# EAGLE design external_strip_v3 (EAGLE 7.2.0)
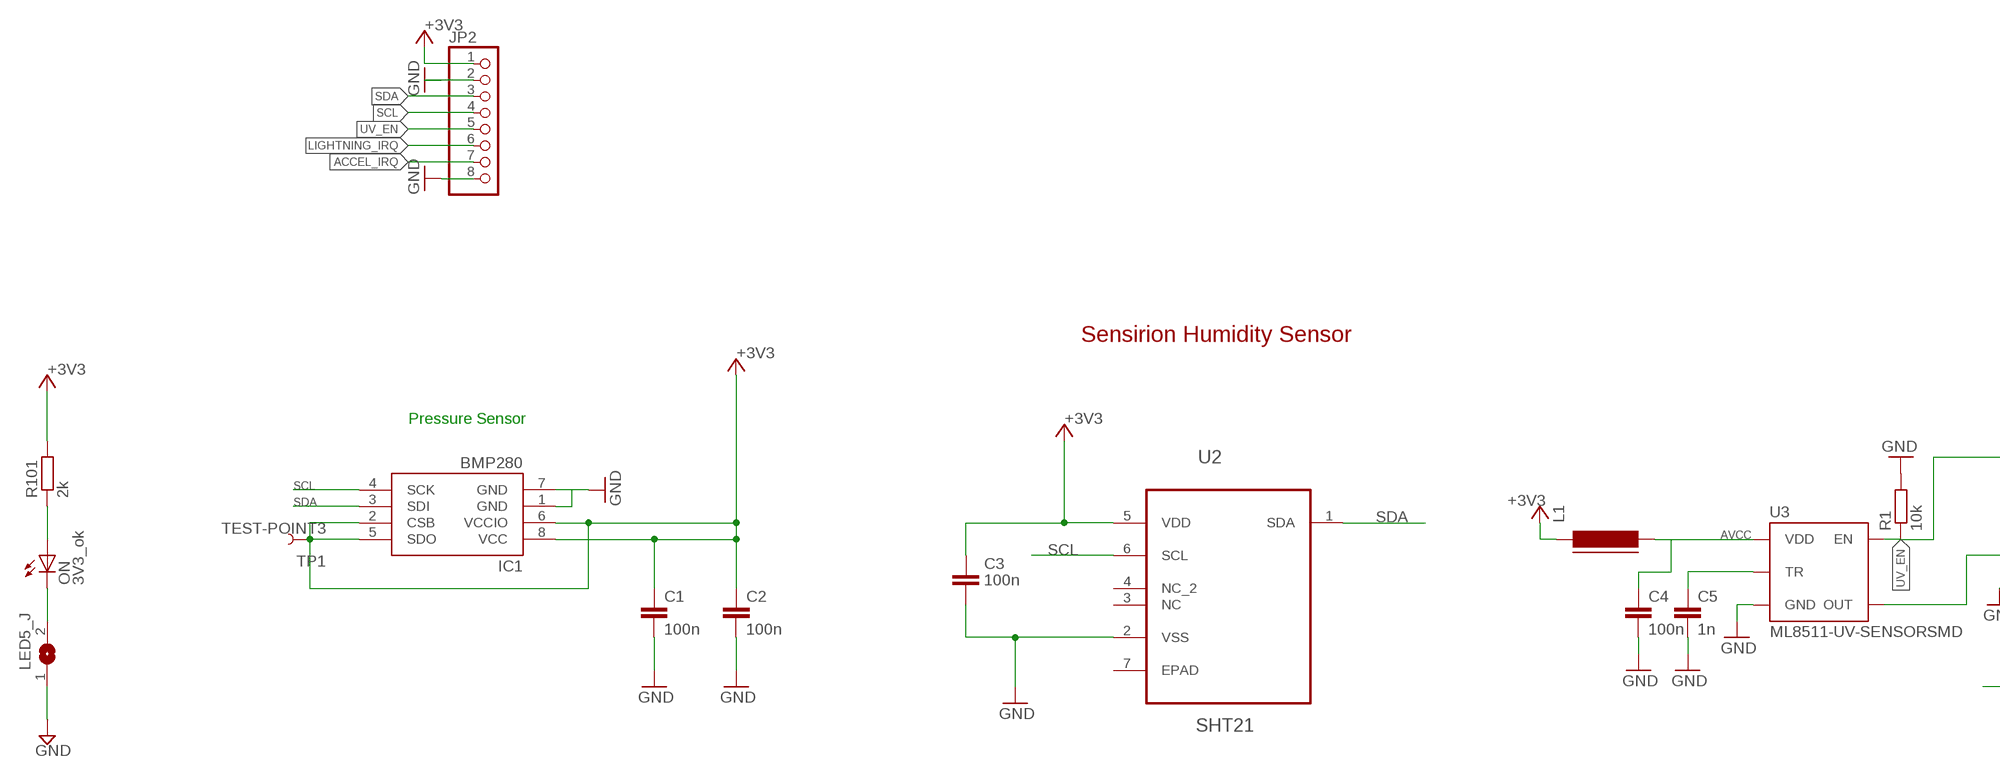
[diagram p0: schematic, sheet 1, part 1 of 2]
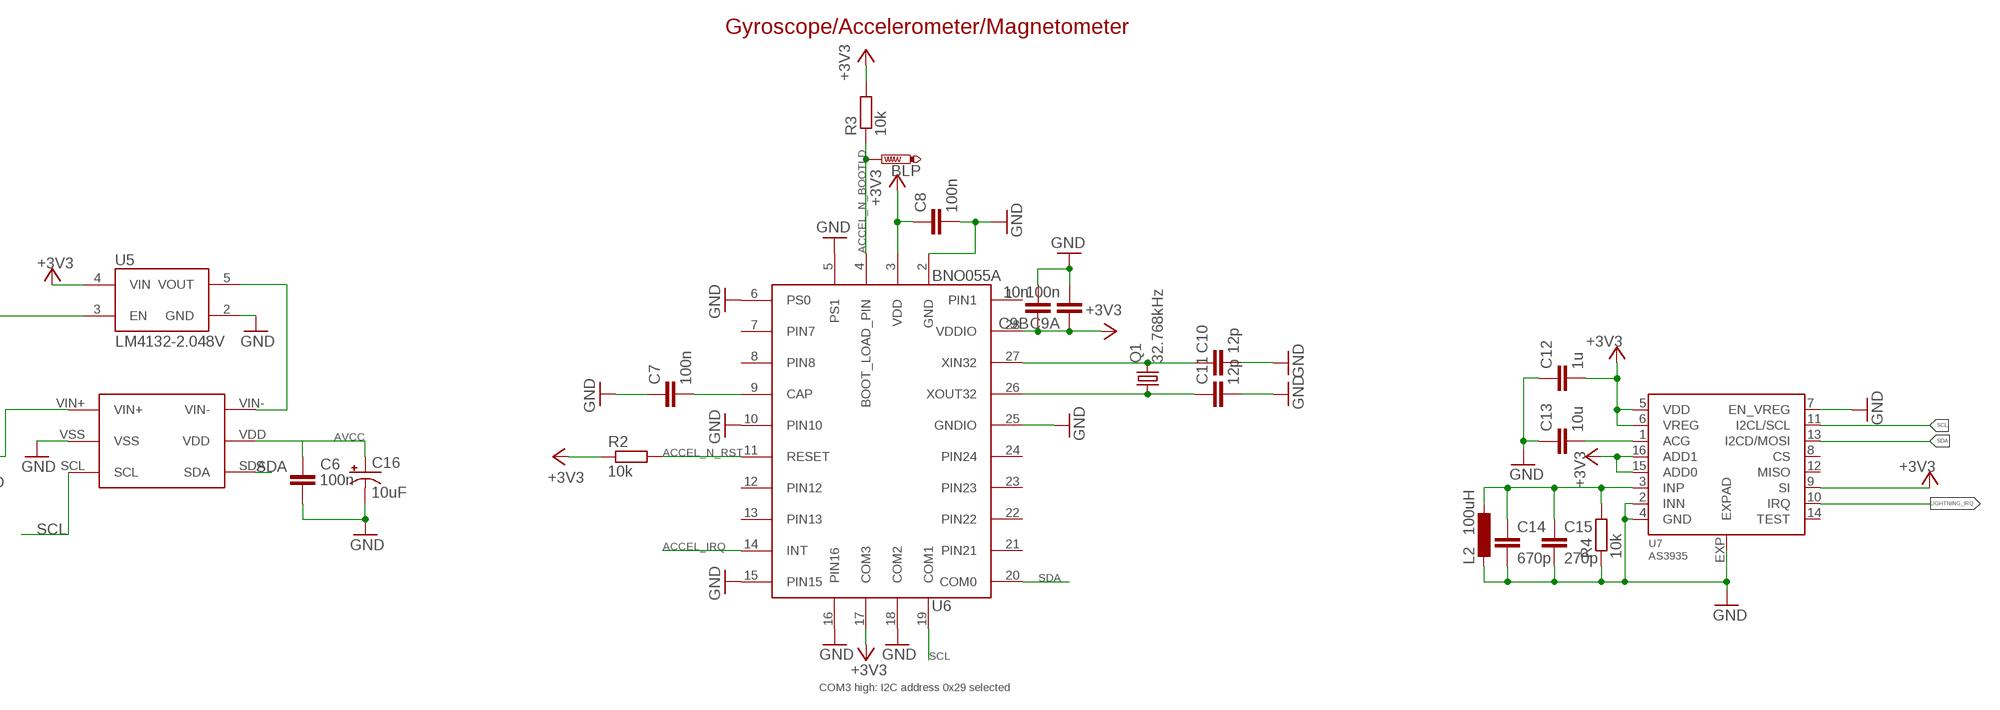
[diagram p1: schematic, sheet 1, part 2 of 2]

## Parts
BLP  PTR1B1,27  [B1,27]
C1  100n  C-EUC0603  [C0603]
C2  100n  C-EUC0603  [C0603]
C3  100n  C-EUC0603  [C0603]
C4  100n  0.1UF-25V(+80/-20%)(0603)  [0603-CAP]
C5  1n  1NF/1000PF-50V-10%(0603)  [0603-CAP]
C6  100n  C-EUC0603  [C0603]
C7  100n  C-EUC0603  [C0603]
C8  100n  C-EUC0603  [C0603]
C9A  100n  C-EUC0603  [C0603]
C9B  10n  C-EUC0603  [C0603]
C10  12p  C-EUC0603  [C0603]
C11  12p  C-EUC0603  [C0603]
C12  1u  C-EUC0603  [C0603]
C13  10u  C-EUC0603  [C0603]
C14  670p  C-EUC0603  [C0603]
C15  270p  C-EUC0603  [C0603]
C16  10uF  10UF-TANT  [EIA3216]
IC1  BMP280  [LGA8]
JP2  PINHD-1X8  [1X08]
L1  FERRITE-0603  [FB603]
L2  100uH  COILCRAFT  [COILCRAFT]
LED5_J  SJ  [SJ]
ON  3V3_ok  LEDCHIPLED_0603  [CHIPLED_0603]
Q1  32.768kHz  FC-12M  [FC-12M]
R1  10k  R-EU_R0603  [R0603]
R2  10k  R-EU_R0603  [R0603]
R3  10k  R-EU_R0603  [R0603]
R4  10k  R-EU_R0603  [R0603]
R101  2k  R-EU_R0603  [R0603]
TP1  TEST-POINT3  [PAD.03X.03]
U2  SHT21  [DFN300X300X110-7N]
U3  ML8511-UV-SENSORSMD  [ML8511]
U4  MCP3425  [SOT-23-6]
U5  LM4132-2.048V  LM4128-2.5VREF  [SOT23-5]
U6  BNO055A  [BNO055]
U7  AS3935  [16LDMLPQ]

## Nets
+3V3 [power]: C1.1 C2.1 C3.1 C8.1 C9A.1 C9B.1 C12.2 IC1.2(CSB) IC1.5(SDO) IC1.6(VCCIO) JP2.1 L1.1 R2.1 R3.2 R101.2 TP1.P$1 U2.5(VDD) U5.4(VIN) U6.3(VDD) U6.17(COM3) U6.28(VDDIO) U7.5(VDD) U7.6(VREG) U7.9(SI) U7.15(ADD0) U7.16(ADD1)
ACCEL_IRQ: JP2.7 U6.14(INT)
ACCEL_N_BOOTLD: BLP.TP R3.1 U6.4(BOOT_LOAD_PIN)
ACCEL_N_RST: R2.2 U6.11(RESET)
AVCC [power]: C4.1 C6.1 C16.A(+) L1.2 U3.7(VDD) U4.VDD
GND: C1.2 C2.2 C3.2 C4.2 C5.2 C6.2 C7.1 C8.2 C9A.2 C9B.2 C10.2 C11.2 C12.1 C13.1 C14.2 C15.2 C16.C(-) IC1.1(GND) IC1.7(GND) JP2.2 JP2.8 L2.2 LED5_J.1 R1.2 R4.1 U2.2(VSS) U3.5(GND) U4.VSS U5.2(GND) U6.2(GND) U6.5(PS1) U6.6(PS0) U6.10(PIN10) U6.15(PIN15) U6.16(PIN16) U6.18(COM2) U6.25(GNDIO) U7.2(INN) U7.4(GND) U7.7(EN_VREG) U7.EXP(EXPAD)
LIGHTNING_IRQ: JP2.6 U7.10(IRQ)
N$1: U3.8(OUT) U4.VIN+
N$2: C13.2 U7.1(ACG)
N$3: C5.1 U3.9(TR)
N$4: LED5_J.2 ON.C
N$5: C14.1 C15.1 L2.1 R4.2 U7.3(INP)
N$6: U4.VIN- U5.5(VOUT)
N$8: ON.A R101.1
N$18: C7.2 U6.9(CAP)
N$19: C10.1 Q1.2 U6.27(XIN32)
N$73: C11.1 Q1.1 U6.26(XOUT32)
SCL: IC1.4(SCK) JP2.4 U2.6(SCL) U4.SCL U6.19(COM1) U7.11(I2CL/SCL)
SDA: IC1.3(SDI) JP2.3 U2.1(SDA) U4.SDA U6.20(COM0) U7.13(I2CD/MOSI)
UV_EN: JP2.5 R1.1 U3.4(EN) U5.3(EN)
Unconnected: U2.3(NC) U2.4(NC_2) U2.7(EPAD) U6.1(PIN1) U6.7(PIN7) U6.8(PIN8) U6.12(PIN12) U6.13(PIN13) U6.21(PIN21) U6.22(PIN22) U6.23(PIN23) U6.24(PIN24) U7.8(CS) U7.12(MISO) U7.14(TEST)

## Notes on the sheet
- Gyroscope/Accelerometer/Magnetometer
- Sensirion Humidity Sensor
- Pressure Sensor
- COM3 high: I2C address 0x29 selected

## Power pins joined to a net without a drawn wire
VCC: IC1.8(VCC)

## Library data of the parts
BLP = testpad:PTR1: TEST PIN
C1-C3 C6-C8 C9A C9B C10-C15 = rcl:C-EU: CAPACITOR, European symbol
C4 = SparkFun-Capacitors:0.1UF-25V(+80/-20%)(0603): CAP-00810 Ceramic Standard decoupling cap; PROD_ID: CAP-00810; VALUE: 0.1uF
C5 = SparkFun-Capacitors:1NF/1000PF-50V-10%(0603): CAP-07886; PROD_ID: CAP-07886; VALUE: 1nF
C16 = SparkFun-Retired:10UF-TANT: 10uF Tantalum SMT CAP-00811- 16V 10% (EIA-3216); PROD_ID: CAP-00811
IC1 = we-sensor:BMP280: Bosch BMP280 Pressure Sensor
JP2 = Headerlibrary:PINHD-1X8: PIN HEADER
L1 = dp_devices:FERRITE: Ferrite bead in various packages
L2 = AS3935:COILCRAFT
LED5_J = jumper:SJ: SMD solder JUMPER
ON = adafruit:LED: LED OSRAM: - CHIPLED LG R971, LG N971, LY N971, LG Q971, LY Q971, LO R971, LY R971 LH N974, LH R974 LS Q976, LO Q976, LY Q976 LO Q996 - Hyper CHIPLED LW Q18S LB Q993, LB Q99A, LB R99A - SideLED LS A670, LO A670, LY A670, LG A670, LP A670 LB A673, LV A673, LT A673, LW A673 LH A674 LY A675 LS A676, LA A676, LO A676, LY A676, LW A676 LS A679, LY A679, LG A679 - Hyper Micro SIDELED® LS Y876, LA Y876, LO Y876, LY Y876 LT Y87S - SmartLED LW L88C, LW L88S LB L89C, LB L89S, LG L890 LS L89K, LO L89K, LY L89K LS L896, LA L896, LO L896, LY L896 - TOPLED LS T670, LO T670, LY T670, LG T670, LP T670 LSG T670, LSP T670, LSY T670, LOP T670, LYG T670 LG T671, LOG T671, LSG T671 LB T673, LV T673, LT T673, LW T673 LH T674 LS T676, LA T676, LO T676, LY T676, LB T676, LH T676, LSB T676, LW T676 LB T67C, LV T67C, LT T67C, LS T67K, LO T67K, LY T67K, LW E67C LS E67B, LA E67B, LO E67B, LY E67B, LB E67C, LV E67C, LT E67C LW T67C LS T679, LY T679, LG T679 LS T770, LO T770, LY T770, LG T770, LP T770 LB T773, LV T773, LT T773, LW T773 LH T774 LS E675, LA E675, LY E675, LS T675 LS T776, LA T776, LO T776, LY T776, LB T776 LHGB T686 LT T68C, LB T68C - Hyper Mini TOPLED® LB M676 - Mini TOPLED Santana® LG M470 LS M47K, LO M47K, LY M47K Source: http://www.osram.convergy.de/
Q1 = crystal:FC-12M: kHz RANGE CRYSTAL UNIT LOW PROFILE SMD Source: Epson Toyocom FC-12M.pdf; URL: http://www.mouser.ch/ProductDetail/ECS/ECS-327-125-12-TR/?qs=sGAEpiMZZMsBj6bBr9Q9adKxTNdvE4KvM1b8HDkgjuY%3d
R1 R4 = resistor:R-EU_: RESISTOR, European symbol
R2 R3 R101 = rcl:R-EU_: RESISTOR, European symbol
TP1 = SparkFun:TEST-POINT
U2 = SENSIRION-SHT21:SHT21: SENSOR, HUMIDITY & TEMP; MPN: SHT21; OC_FARNELL: 1855468; OC_NEWARK: 20T1172; PACKAGE: DFN-6; SUPPLIER: SENSIRION
U3 = SparkFun-Sensors:ML8511-UV-SENSOR; PROD_ID: IC-11927
U4 = phMeter:MCP3425
U5 = SparkFun:LM4128-2.5VREF
U6 = BNO055:BNO055
U7 = AS3935:AS3935

## Net classes
0 default: width 0.305 mm
1 power: width 0.203 mm, drill 0.305 mm, clearance 0.152 mm

## Board
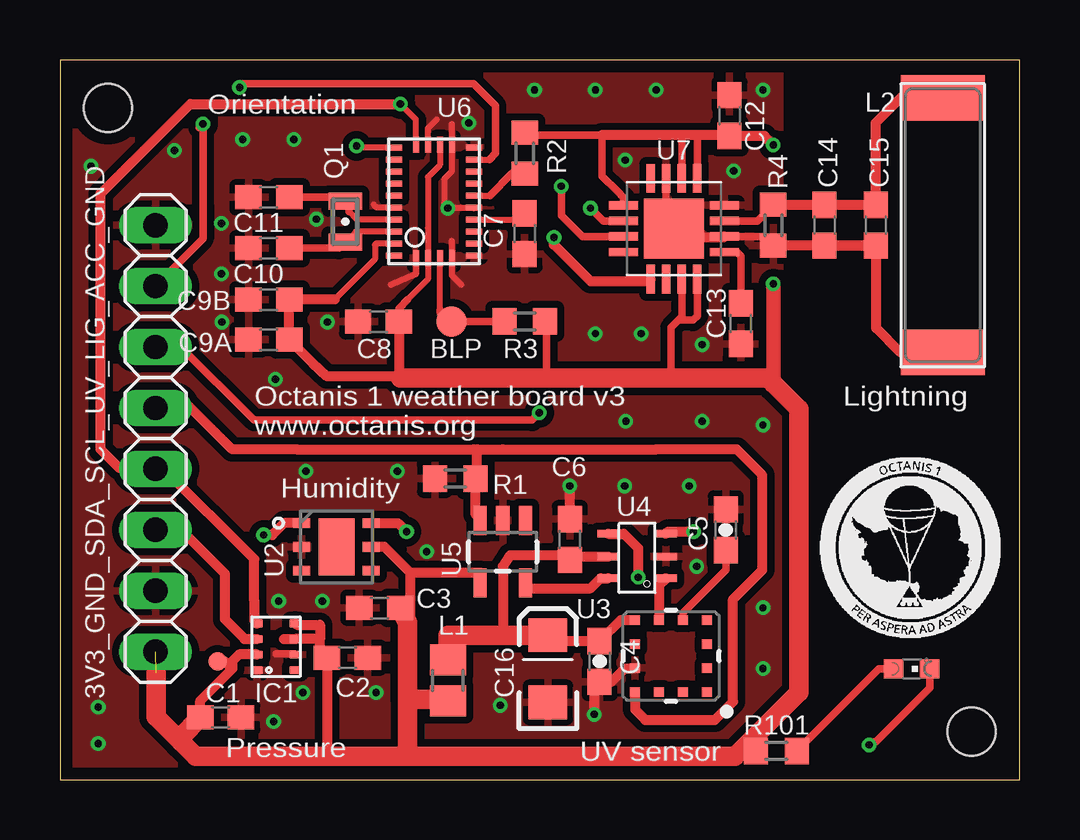
[diagram p2: board, top side]
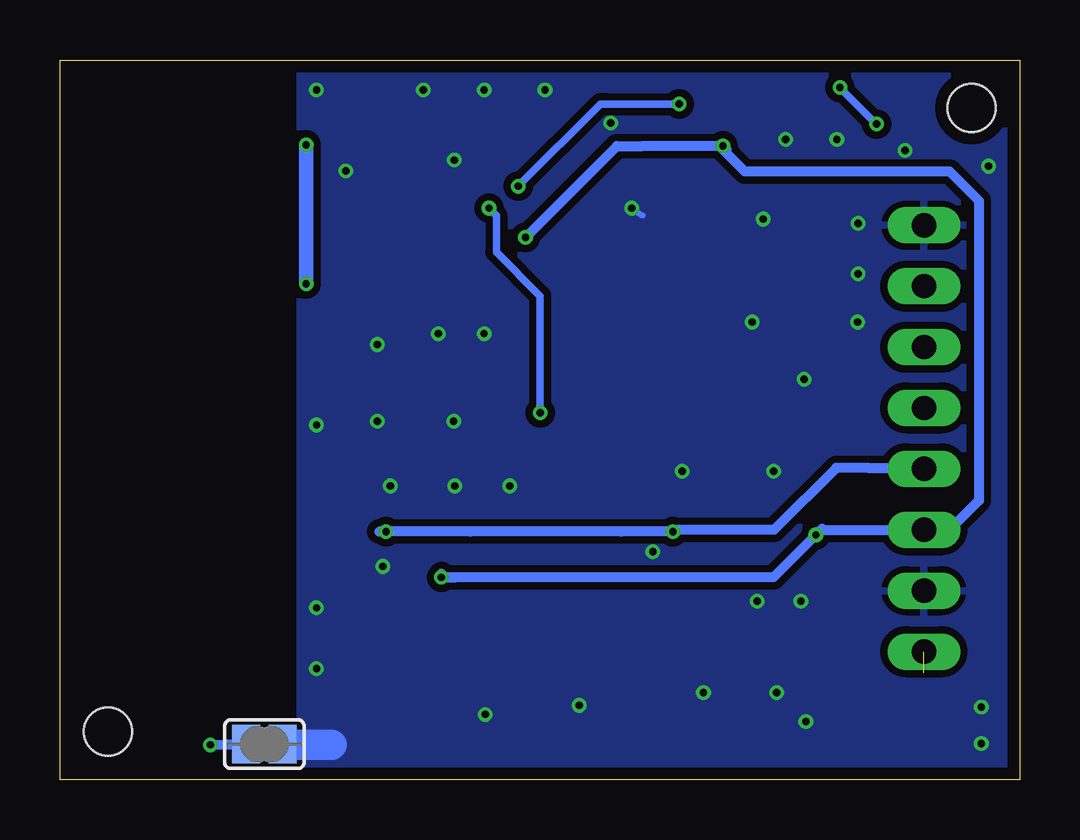
[diagram p3: board, bottom side, seen from below]

Size 40 x 30 mm. Coordinates in mm from the lower left corner, seen from the top.
Outline: 0,0 40,0 40,30 0,30 0,0
Copper layers (1*16): Top 0.035mm / dielectric 1.6mm / Bottom 0.035mm
Design rules "Elecrow_2-layer_PCB_eagle_rule": minimum track width 6mil, minimum drill 12mil, track to track 6mil, track to pad 6mil, pad to pad 6mil, via to via 8mil, smd to smd 0mil, copper to edge 20mil, drill to drill 10mil, minimum pad ring 6mil, minimum via ring 6mil, stop-mask expansion 0mil, vias tented up to drill 100mil, thermal gap 10mil
Holes 2 mm at 2,28 38,2

### Footprints (pad centres in the part's own frame; a part is rotated, then mirrored left to right if it is on the bottom)
B1,27 = smd 1.27 x 1.27: TP 0,0
C0603 = smd 1.1 x 1: 1 -0.85,0; 2 0.85,0
0603-CAP = smd 1.1 x 1: 1 -0.85,0; 2 0.85,0
EIA3216 = smd 1.4 x 1.6: A 1.4,0; C -1.4,0
LGA8 = smd 0.5 x 0.35: 1 0.8,0.975; 2 0.8,0.325; 3 0.8,-0.325; 4 0.8,-0.975; 5 -0.8,-0.975; 6 -0.8,-0.325; 7 -0.8,0.325; 8 -0.8,0.975
1X08 = drill 1.016 long: 1 -8.89,0; 2 -6.35,0; 3 -3.81,0; 4 -1.27,0; 5 1.27,0; 6 3.81,0; 7 6.35,0; 8 8.89,0
FB603 = smd 1.3 x 1.5: 1 -0.85,0; 2 0.85,0
COILCRAFT = smd 1.9 x 3.5: 1 -5.3,0.05; 2 5.3,0.05
SJ = smd 1.168 x 1.6: 1 -0.762,0; 2 0.762,0
CHIPLED_0603 = smd 0.8 x 0.8: A 0,-0.75; C 0,0.75
FC-12M = smd 0.7 x 1.4: 1 -0.85,0; 2 0.85,0
R0603 = smd 1 x 1.1: 1 -0.85,0; 2 0.85,0
PAD.03X.03 = smd 0.762 x 0.762: P$1 0,0
DFN300X300X110-7N = smd 0.711 x 0.406: 1 -1.448,0.991; 2 -1.448,0; 3 -1.448,-0.991; 4 1.448,-0.991; 5 1.448,0; 6 1.448,0.991 | smd 1.499 x 2.388: 7 0,0
ML8511 = smd 0.4 x 0.4: 1 1.5,-1.5; 2 0.5,-1.5; 3 -0.5,-1.5; 4 -1.5,-1.5; 5 -1.5,-0.5; 6 -1.5,0.5; 7 -1.5,1.5; 8 -0.5,1.5; 9 0.5,1.5; 10 1.5,1.5; 11 1.5,0.5; 12 1.5,-0.5
SOT-23-6 = smd 0.305 x 0.9: SCL 2.45,-0.45; SDA 2.45,1.95; VDD 1.5,1.95; VIN+ 0.6,-0.45; VIN- 0.6,1.95; VSS 1.5,-0.45
SOT23-5 = smd 0.55 x 1.2: 1 -0.95,-1.3; 2 0,-1.3; 3 0.95,-1.3; 4 0.95,1.3; 5 -0.95,1.3
BNO055 = smd 0.675 x 0.25: 1 1.663,2.25; 6 -1.665,2.25; 7 -1.665,1.75; 8 -1.665,1.25; 9 -1.665,0.75; 10 -1.665,0.25; 11 -1.665,-0.25; 12 -1.665,-0.75; 13 -1.665,-1.25; 14 -1.665,-1.75; 15 -1.665,-2.25; 20 1.663,-2.25; 21 1.663,-1.75; 22 1.663,-1.25; 23 1.663,-0.75; 24 1.663,-0.25; 25 1.663,0.25; 26 1.663,0.75; 27 1.663,1.25; 28 1.663,1.75 | smd 0.25 x 0.675: 2 0.75,2.362; 3 0.25,2.362; 4 -0.25,2.362; 5 -0.75,2.362; 16 -0.75,-2.362; 17 -0.25,-2.362; 18 0.25,-2.362; 19 0.75,-2.362
16LDMLPQ = smd 1.2 x 0.35: 1 -2.1,0.975; 2 -2.1,0.325; 3 -2.1,-0.325; 4 -2.1,-0.975; 9 2.1,-0.975; 10 2.1,-0.325; 11 2.1,0.325; 12 2.1,0.975 | smd 0.35 x 1.2: 5 -0.975,-2.1; 6 -0.325,-2.1; 7 0.325,-2.1; 8 0.975,-2.1; 13 0.975,2.1; 14 0.325,2.1; 15 -0.325,2.1; 16 -0.975,2.1 | smd 2.5 x 2.5: EXP 0,0

### Placement (x,y rotation side)
BLP  16.33,19.1 0 top
C1  6.7,2.59 0 top
C2  11.98,5.08 0 top
C3  13.33,7.16 180 top
C4  22.5,4.92 270 top
C5  27.76,10.41 90 top
C6  21.25,10 90 top
C7  19.37,22.76 90 top
C8  13.28,19.1 180 top
C9A  8.71,18.34 180 top
C9B  8.71,20.01 180 top
C10  8.71,22.15 180 top
C11  8.71,24.28 180 top
C12  27.91,27.68 270 top
C13  28.38,19.01 90 top
C14  31.87,23.11 270 top
C15  34,23.11 270 top
C16  20.34,4.62 90 top
IC1  9.01,5.53 180 top
JP2  3.98,14.22 90 top
L1  16.17,4.14 90 top
L2  36.75,23.11 270 top
LED5_J  31.48,1.47 180 bottom
ON  35.5,4.62 270 top
Q1  11.89,23.26 270 top
R1  16.48,12.54 180 top
R2  19.37,26.11 270 top
R3  19.37,19.1 0 top
R4  29.74,23.11 90 top
R101  29.86,1.2 180 top
TP1  6.57,4.92 0 top
U2  11.53,9.7 0 top
U3  25.47,5.15 0 top
U4  24.81,7.79 90 top
U5  18.46,9.5 180 top
U6  15.59,24.1 180 top
U7  25.6,22.96 180 top

### Tracks (layer width: path | path; a pad name or v marks a point on that pad's centre or on a via)
+3V3  (via drill 0.3)  (1 unrouted)
  Top 0.254: U6.17 15.84,25.62 15.34,25.12 15.34,22.99 | 15.34,22.99 U6.3 | U6.28 13.18,22.35 13.12,22.3 13.12,21.69 11.45,20.01 | 15.34,22.99 15.34,20.86 14.5,20.01
  Top 0.305: 28.52,16.74 25.47,16.74 | 25.47,16.74 24.86,16.74 | 14.19,16.74 20.29,16.74 20.29,19.03 arc90 R3.2 | 14.5,20.01 14.13,19.64 C8.1 | U7.16 26.57,19.33 26.38,19.15 25.77,19.15 | U7.15 25.92,19.29 25.77,19.15 | U7.6 25.92,26.87 | U7.9 23.5,24.27 23.23,24.53 22.6,25.17 22.6,26.87 19.46,26.87 R2.1 | 25.77,19.15 25.47,18.84 25.47,16.74 | U7.5 26.57,26.87 26.69,26.87
  Top 0.406: C8.1 14.13,16.8 14.19,16.74 14.19,16.81 11.14,16.81 10.53,17.36 C9A.1 | U5.4 17.54,8.62 14.61,8.62 | 14.48,6.55 14.61,6.67 14.61,8.62 | 14.61,8.62 13.53,9.7 U2.5 | C9A.1 9.47,18.25 | C9A.1 C9B.1 11.45,20.01 | 11.14,0.96 11.14,3.1 11.14,3.71 11.14,5.06 C2.1 10.84,5.37 10.84,5.84 | 10.84,5.84 10.82,5.86 IC1.6 9.34,5.86 | IC1.5 9.87,6.45 10.84,6.45 10.84,5.84 | IC1.2 7.47,5.21 7.18,4.92 7.18,4.62 | TP1.P$1 6.88,4.92 7.18,4.62 | C1.1 5.85,3.29 7.18,4.62 | v29.74,26.46 29.37,26.83 C12.2 27.87,26.87 26.69,26.87 25.92,26.87 22.6,26.87 | R101.2 28.78,0.96 28.04,0.96
  Top 0.61: v29.74,20.67 29.74,16.51
  Top 0.813: 14.19,16.74 20.29,16.74 24.86,16.74 25.47,16.74 28.52,16.74 29.51,16.74 29.74,16.51 30.8,15.44 30.8,3.63 28.14,0.96 28.04,0.96 14.19,0.96 | 14.48,3.35 14.48,6.55 C3.1 | L1.1 16.17,3.35 14.48,3.35 | 14.19,0.96 11.14,0.96 9.93,0.96 7.49,0.96 5.66,0.96 5.05,1.57 | 5.05,1.57 4,2.62 4,4.45 | C1.1 5.05,1.79 5.05,1.57 | 14.48,3.35 14.48,1.25 14.19,0.96
  Bottom 0.61: v29.74,26.46 v29.74,20.67
ACCEL_IRQ  (via drill 0.3)
  Top 0.254: U6.14 17.9,25.85
  Top 0.305: 17.9,25.85 18.15,26.11 18.15,28.09 17.24,29 7.64,29 v7.49,28.85 | JP2.7 5.96,22.55 5.96,23.98 v5.96,27.33 5.81,27.18
  Bottom 0.305: v5.96,27.33 v7.49,28.85
ACCEL_N_BOOTLD
  Top 0.254: 15.84,19.58 U6.4
  Top 0.305: 15.84,19.58 arc90 BLP.TP R3.1
ACCEL_N_RST
  Top 0.254: U6.11 17.92,24.35
  Top 0.305: 17.92,24.35 18.83,25.26 R2.2
AVCC
  Top 0.406: U3.7 23.38,6.65 C4.1 20.34,5.78 C16.A 20.29,6.07 | U4.VDD 21.39,9.29 C6.1 21.22,9.34 18.76,9.34 18.46,8.89 18.46,6.02
  Top 0.813: L1.2 16.17,6.02 18.46,6.02 C16.A
GND  (via drill 0.3)
  Top 0.203: U6.16 16.33,26.48
  Top 0.254: U6.2 14.84,21.07 13.79,20.62 | U6.25 13.2,23.85 13.07,23.98 | 16.34,21.01 16.73,20.62 | U6.18 15.34,27.16 15.72,27.53 | 16.33,26.48 16.33,25.35 16.02,25.04 16.02,23.82 v16.17,23.82 17.26,23.82 U6.10 | U6.16 16.34,27.33 16.33,27.33 | U6.5 16.34,22.45 16.33,22.45 16.33,21.08
  Top 0.305: R4.1 29.36,22.64 U7.2 | U7.EXP 25.27,23.29 U7.7 | IC1.7 9.79,5.23 9.01,5.23
  Top 0.406: C15.2 C14.2 | C14.2 R4.1 | C14.2 C15.2 | L2.2 35.04,17.81 34.03,18.82 34.03,22.23 C15.2 | U3.5 23.94,4.62 23.54,4.62 22.99,4.08 C4.2 22.27,3.99 v22.27,2.71 | C6.2 v21.25,12.24 | U7.2 27.66,22.6 26.08,22.6 25.72,22.96 U7.EXP
  Bottom 0.254: v16.17,23.82 15.72,23.52
  Bottom 1.27: LED5_J.1 30.69,1.45 28.67,1.45
  other vias: 28.09,25.37 22.32,18.59 22.32,28.75 24.86,28.75 29.3,28.75 23.54,12.24 14.06,12.85 10.26,12.85 9.11,7.44 19.78,28.75 26.23,12.24 29.3,4.62 11.14,19.07 23.56,25.83 8.91,2.41 18.36,3.1 10.69,23.37 29.3,7.16 9.75,26.69 10.13,3.63 13.18,3.63 10.94,7.44 24.23,18.59 4.77,26.24 6.72,23.19 6.75,19.07 8.98,16.68 23.59,14.93 26.77,14.93 29.3,14.78 26.54,8.89 26.77,18.13 15.28,9.5 6.72,21.08 7.61,26.69 17.04,27.38 1.59,3.02 1.29,25.57 1.59,1.5
  pour Bottom (isolate 0.305): 30,30 30,0 0,0 0,30
  pour Top (isolate 0.305): 0,0 30,0 30,30 0,30
LIGHTNING_IRQ  (via drill 0.3)
  Top 0.305: U7.10 22.65,23.29 v22.12,23.82 | v19.98,15.29 19.68,14.98 9.01,14.98 8.1,14.98 5,18.08
  Top 0.406: 5,18.08 4.95,18.03 JP2.6
  Bottom 0.305: v22.12,23.82 21.81,23.52 21.81,21.99 19.98,20.16 v19.98,15.29
N$1
  Top 0.406: U4.VIN+ 24.97,8.11 U3.8
N$2
  Top 0.305: U7.1 28.21,21.99 28.38,21.82 C13.2
N$3
  Top 0.305: 27.76,9.34 27.76,8.73 26.38,7.36 25.97,6.95 U3.9
  Top 0.406: 27.76,9.34 C5.1
N$4  (via drill 0.3)
  Top 0.305: ON.C 36.25,3.82 34,1.57 33.85,1.57 v33.73,1.45
  Top 0.406: 33.84,1.45 v33.73,1.45
  Bottom 0.406: v33.73,1.45 33.09,1.47 LED5_J.2
N$5
  Top 0.305: U7.3 29.07,23.29 R4.2
  Top 0.406: R4.2 C14.1 | C14.1 C15.1 | C15.1 34,27.38 35.53,28.9 36.31,28.9 L2.1 | C14.1 C15.1
N$6
  Top 0.406: U5.5 19.63,7.97 22.12,7.97 22.54,8.39 U4.VIN-
N$8
  Top 0.305: R101.1 34.13,4.62 ON.A
N$18
  Top 0.254: U6.9 19.37,23.35
  Top 0.305: 19.37,23.35 C7.2
N$19
  Top 0.254: U6.27 12.34,22.85 Q1.2
  Top 0.305: Q1.2 11.63,22.15 C10.1
N$73
  Top 0.254: U6.26 12.37,23.35 12.06,23.67
  Top 0.305: 12.06,23.67 12.06,23.94 Q1.1 11.72,24.28 C11.1
SCL  (via drill 0.3)
  Top 0.254: U6.19 14.84,27.52 v14.19,28.17
  Top 0.305: U7.11 21.78,22.64 20.9,23.52 20.9,24.43 v20.9,24.74 | 4.29,13 4.24,12.95 JP2.4
  Top 0.406: U2.6 14.09,10.69 v14.45,10.34 | U4.SCL 25.35,10.34 v26.41,10.34 | 4.29,13 8.1,9.19 8.1,7.44 8.1,6.62 IC1.4 | 14.12,28.09 v14.19,28.17 5.43,28.17 1.7,24.43 1.7,13.76 2.46,13 3.93,13 arc-90 JP2.4
  Bottom 0.305: v14.19,28.17 17.24,28.17 17.47,28.17 v20.9,24.74
  Bottom 0.406: v14.45,10.34 16.61,10.34 | 16.61,10.34 22.9,10.34 26.69,10.34 | 26.69,10.34 v26.41,10.34 | v26.41,10.34 26.69,10.34 | 26.69,10.34 v26.41,10.34 | v14.19,28.17 14.34,28.17 | v14.45,10.34 16.61,10.34 | v26.41,10.34 26.69,10.34 | v14.45,10.34 14.37,10.41 10.23,10.41 7.64,13 6.32,13 4.03,13 arc90 JP2.4
SDA  (via drill 0.3)
  Top 0.254: U6.20 12.42,26.35
  Top 0.305: 5,10.46 4.95,10.41 JP2.3
  Top 0.406: U2.1 9.34,10.69 8.84,10.2 v8.49,10.2 | 12.42,26.35 v12.36,26.41 | U4.SDA 23.5,10.24 24.1,9.65 v24.1,8.43 | 5,10.46 6.88,8.58 6.88,6.68 7.7,5.86 IC1.3 | U7.13 24.53,20.77 22.12,20.77 20.59,22.3 v20.59,22.6
  Bottom 0.305: 2.87,10.46 2.91,10.41 JP2.3
  Bottom 0.406: 22.12,8.43 10.26,8.43 v8.49,10.2 | 22.12,8.43 23.79,8.43 | 23.79,8.43 23.95,8.43 | 23.95,8.43 v24.1,8.43 | 22.12,8.43 23.18,8.43 | v12.36,26.41 12.21,26.26 | 23.95,8.43 23.79,8.43 | 23.79,8.43 23.49,8.43 | v24.1,8.43 23.79,8.43 | 24.1,8.58 v24.1,8.43 | v8.49,10.2 8.22,10.46 | v8.49,10.2 8.22,10.46 | 2.87,10.46 1.7,11.63 1.7,24.13 2.91,25.35 11.45,25.35 12.36,26.26 v12.36,26.41 | v12.36,26.41 15.72,26.41 16.78,26.41 v20.59,22.6 | 8.22,10.46 8.18,10.41 JP2.3
UV_EN
  Top 0.406: 17.39,13.76 17.24,13.76 9.87,13.76 7.18,13.76 5.41,15.54 4.03,15.54 arc90 JP2.5 | 17.39,13.76 18.46,13.76 24.86,13.76 28.21,13.76 29.28,12.7 29.28,8.73 28.06,7.52 28.06,3.25 27.76,2.94 27.3,2.49 24.4,2.49 23.97,2.92 U3.4 | U5.3 17.55,10.83 17.33,11.05 R1.1 | R1.1 17.24,12.3 | R1.1 17.39,12.61 17.39,13.76

### Text on the board
tNames: Orientation | Octanis 1 weather board v3 | Lightning | www.octanis.org | Humidity | U4 | U3 | 3V3_GND_SDA_SCL_UV_LIG_ACC_GND | Pressure | UV sensor
tValues: MCP3425 | ML8511